# Altium schematic sheet RcMPPT-IO.SchDoc: RcMPPT-BMS-IO
size A4; Author: Thomas Hofmann; CompanyName: HTL St. Pölten; Organization: HTL St. Pölten; Address1: RcMPPT; Address2: Frenchs Forest; Address3: NSW; Address4: Australia 2086; DocumentNumber: 5; Revision: 2.0; SheetNumber: 5; SheetTotal: 5
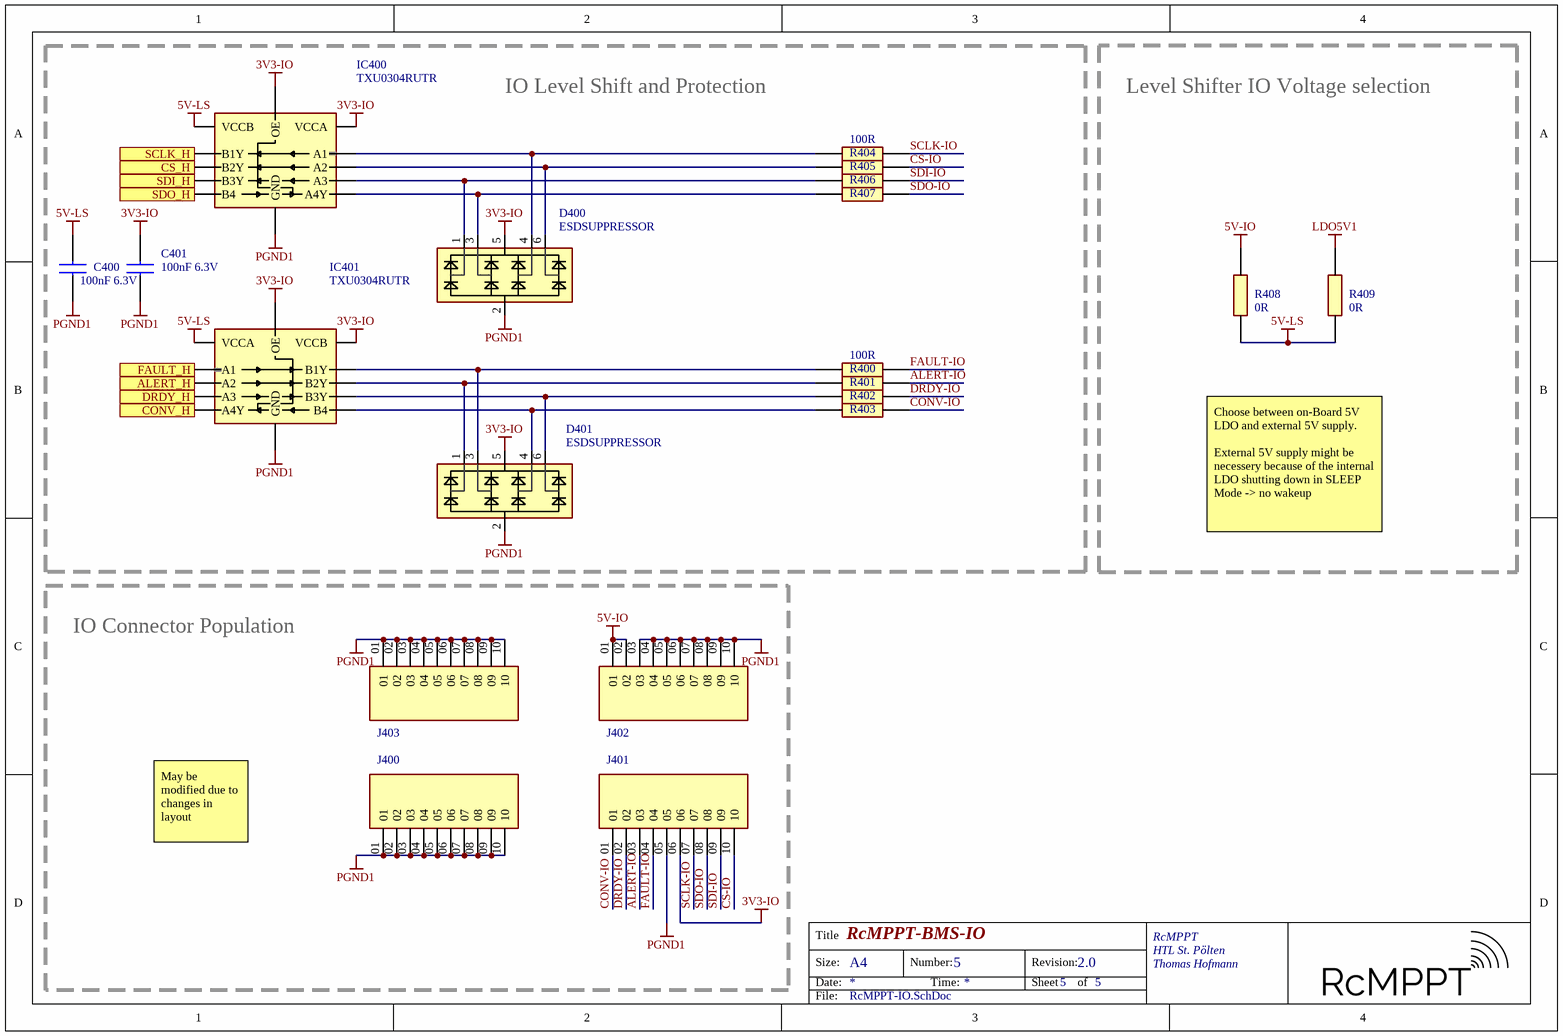
[diagram p0: RcMPPT-IO.SchDoc]

## Parts
C400  100nF 6.3V  [CAPC1608X97N]
C401  100nF 6.3V  [CAPC1608X97N]
D400  ESDSUPPRESSOR  [SOT23-6]
D401  ESDSUPPRESSOR  [SOT23-6]
IC400  TXU0304RUTR  [UQFN-12]
IC401  TXU0304RUTR  [UQFN-12]
J400  SMS-110-01-G-S  [SAMTEC_SMS-110-X-X-S]  (value not drawn)
J401  SMS-110-01-G-S  [SAMTEC_SMS-110-X-X-S]  (value not drawn)
J402  SMS-110-01-G-S  [SAMTEC_SMS-110-X-X-S]  (value not drawn)
J403  SMS-110-01-G-S  [SAMTEC_SMS-110-X-X-S]  (value not drawn)
R400  100R  [RESC1005X40N]
R401  100R  [RESC1005X40N]  (value not drawn)
R402  100R  [RESC1005X40N]  (value not drawn)
R403  100R  [RESC1005X40N]  (value not drawn)
R404  100R  [RESC1005X40N]
R405  100R  [RESC1005X40N]  (value not drawn)
R406  100R  [RESC1005X40N]  (value not drawn)
R407  100R  [RESC1005X40N]  (value not drawn)
R408  0R  [RESC1005X40N]
R409  0R  [RESC1005X40N]

## Blocks framed on the sheet
IO Level Shift and Protection: C400 C401 D400 D401 IC400 IC401 R400-R407
Level Shifter IO Voltage selection: R408 R409
IO Connector Population: J400-J403

## Ports
ALERT_H (in), CONV_H (out), CS_H (out), DRDY_H (in), FAULT_H (in), SCLK_H (out), SDI_H (out), SDO_H (in)

## Nets
3V3-IO: C401.2 D400.5(VDD) D401.5(VDD) IC400.1,_13(VCCA) IC400.12(OE) IC401.11(VCCB) IC401.12(OE) J401.06
5V-IO: J402.01 J402.02 R408.2
5V-LS: C400.2 IC400.11(VCCB) IC401.1,_13(VCCA) R408.1 R409.1
LDO5V1: R409.2
PGND1: C400.1 C401.1 D400.2(GND) D401.2(GND) IC400.6(GND) IC401.6(GND) J400.01 J400.02 J400.03 J400.04 J400.05 J400.06 J400.07 J400.08 J400.09 J400.10 J401.05 J402.03 J402.04 J402.05 J402.06 J402.07 J402.08 J402.09 J402.10 J403.01 J403.02 J403.03 J403.04 J403.05 J403.06 J403.07 J403.08 J403.09 J403.10
ALERT-IO: J401.03 R401.2
ALERT_H: IC401.3(A2) ; port ALERT_H
CONV-IO: J401.01 R403.2
CONV_H: IC401.5(A4Y) ; port CONV_H
CS-IO: J401.10 R405.2
CS_H: IC400.9(B2Y) ; port CS_H
DRDY-IO: J401.02 R402.2
DRDY_H: IC401.4(A3) ; port DRDY_H
FAULT-IO: J401.04 R400.2
FAULT_H: IC401.2(A1) ; port FAULT_H
SCLK-IO: J401.07 R404.2
SCLK_H: IC400.10(B1Y) ; port SCLK_H
SDI-IO: J401.09 R406.2
SDI_H: IC400.8(B3Y) ; port SDI_H
SDO-IO: J401.08 R407.2
SDO_H: IC400.7(B4) ; port SDO_H
NetD400_1: D400.1(CH1) IC400.4(A3) R406.1
NetD400_3: D400.3(CH2) IC400.5(A4Y) R407.1
NetD400_4: D400.4(CH3) IC400.2(A1) R404.1
NetD400_6: D400.6(CH4) IC400.3(A2) R405.1
NetD401_1: D401.1(CH1) IC401.9(B2Y) R401.1
NetD401_3: D401.3(CH2) IC401.10(B1Y) R400.1
NetD401_4: D401.4(CH3) IC401.7(B4) R403.1
NetD401_6: D401.6(CH4) IC401.8(B3Y) R402.1

## Notes on the sheet
- Choose between on-Board 5V LDO and external 5V supply.
  External 5V supply might be necessery because of the internal LDO shutting down in SLEEP Mode -> no wakeup
- May be modified due to changes in layout
- Title
- Size:
- Date:
- A4
- Number:
- Time:
- Revision:
- Sheet
- of
- RcMPPT
- File:

## Library data of the parts
C400 C401 = C0603: Capacitor; Height: 0.97
D400 D401 = ESDSUPPRESSOR: TVS Diode Array; Height: 0.6mm
IC400 IC401 = TXU0304RUTR: Integrated Circuit; Manufacturer_Name: Texas Instruments; Datasheet Link: https://www.ti.com/lit/ds/symlink/txu0304.pdf?ts=1639746896730&ref_url=https%253A%252F%252Fwww.ti.com%252Fproduct%252FTXU0304; Manufacturer_Part_Number: TXU0304RUTR; Mouser Part Number: 595-TXU0304RUTR; Mouser Price/Stock: https://www.mouser.at/ProductDetail/Texas-Instruments/TXU0304RUTR?qs=pBJMDPsKWf1XxvxZVB4EQA%3D%3D
J400-J403 = SMS-110-X-X-S: 10 Position Receptacle Connector 0.050" (1.27mm) Through Hole Gold; MF: {'manufacturer': u'Samtec'}; Package: None; Availability: Unavailable; Value: *; MP: SMS-110-X-X-S; Price: None
R400-R409 = R0402: Resistor; Height: 0.4mm